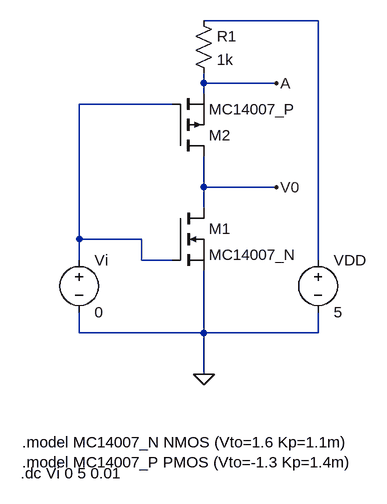
[diagram p0: schematic 1.3.1.asc]
1.3.1.asc, the LTspice schematic file:
Version 4
SHEET 1 880 680
WIRE 512 -320 336 -320
WIRE 336 -224 336 -240
WIRE 448 -224 336 -224
WIRE 336 -208 336 -224
WIRE 288 -192 144 -192
WIRE 336 -64 336 -112
WIRE 448 -64 336 -64
WIRE 336 -32 336 -64
WIRE 144 16 144 -192
WIRE 240 16 144 16
WIRE 144 48 144 16
WIRE 240 48 240 16
WIRE 288 48 240 48
WIRE 512 48 512 -320
WIRE 144 160 144 128
WIRE 336 160 336 64
WIRE 336 160 144 160
WIRE 512 160 512 128
WIRE 512 160 336 160
WIRE 336 224 336 160
FLAG 336 224 0
FLAG 448 -64 V0
FLAG 448 -224 A
SYMBOL voltage 144 32 R0
WINDOW 123 0 0 Left 0
WINDOW 39 0 0 Left 0
SYMATTR InstName Vi
SYMATTR Value 0
SYMBOL voltage 512 32 R0
SYMATTR InstName VDD
SYMATTR Value 5
SYMBOL nmos 288 -32 R0
SYMATTR InstName M1
SYMATTR Value MC14007_N
SYMBOL res 320 -336 R0
SYMATTR InstName R1
SYMATTR Value 1k
SYMBOL pmos 288 -112 M180
SYMATTR InstName M2
SYMATTR Value MC14007_P
TEXT 56 328 Left 2 !.model MC14007_N NMOS (Vto=1.6 Kp=1.1m)\n.model MC14007_P PMOS (Vto=-1.3 Kp=1.4m)
TEXT 54 376 Left 2 !.dc Vi 0 5 0.01

The netlist it stands for:
* 1.3.1.asc
Vi N002 0 0
VDD N001 0 5
M1 V0 N002 0 0 MC14007_N
R1 N001 A 1k
M2 V0 N002 A A MC14007_P
.model NMOS NMOS
.model PMOS PMOS
.lib standard.mos
.model MC14007_N NMOS (Vto=1.6 Kp=1.1m)
.model MC14007_P PMOS (Vto=-1.3 Kp=1.4m)
.dc Vi 0 5 0.01
.backanno
.end